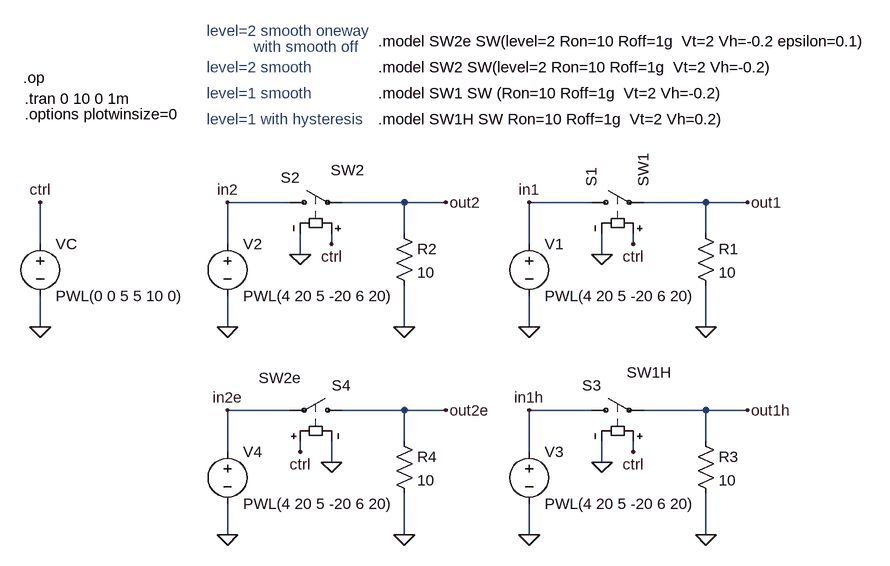
[diagram p0: schematic sw_level2_eps.asc]
sw_level2_eps.asc, the LTspice schematic file:
Version 4
SHEET 1 1444 680
WIRE 208 80 112 80
WIRE 384 80 288 80
WIRE 448 80 384 80
WIRE 672 80 576 80
WIRE 848 80 752 80
WIRE 912 80 848 80
WIRE 384 128 384 80
WIRE 848 128 848 80
WIRE -176 144 -176 80
WIRE 112 144 112 80
WIRE 272 144 272 128
WIRE 576 144 576 80
WIRE 736 144 736 128
WIRE 224 160 224 128
WIRE 688 160 688 128
WIRE -176 272 -176 224
WIRE 112 272 112 224
WIRE 384 272 384 208
WIRE 576 272 576 224
WIRE 848 272 848 208
WIRE 208 400 112 400
WIRE 384 400 288 400
WIRE 448 400 384 400
WIRE 672 400 576 400
WIRE 848 400 752 400
WIRE 912 400 848 400
WIRE 384 448 384 400
WIRE 848 448 848 400
WIRE 112 464 112 400
WIRE 224 464 224 448
WIRE 576 464 576 400
WIRE 736 464 736 448
WIRE 272 480 272 448
WIRE 688 480 688 448
WIRE 112 592 112 544
WIRE 384 592 384 528
WIRE 576 592 576 544
WIRE 848 592 848 528
FLAG 112 272 0
FLAG 384 272 0
FLAG 224 160 0
FLAG -176 272 0
FLAG 272 144 ctrl
FLAG -176 80 ctrl
FLAG 448 80 out2
FLAG 112 80 in2
FLAG 576 272 0
FLAG 848 272 0
FLAG 688 160 0
FLAG 736 144 ctrl
FLAG 912 80 out1
FLAG 576 80 in1
FLAG 576 592 0
FLAG 848 592 0
FLAG 688 480 0
FLAG 736 464 ctrl
FLAG 912 400 out1h
FLAG 576 400 in1h
FLAG 112 592 0
FLAG 384 592 0
FLAG 272 480 0
FLAG 224 464 ctrl
FLAG 448 400 out2e
FLAG 112 400 in2e
SYMBOL voltage 112 128 R0
SYMATTR InstName V2
SYMATTR Value PWL(4 20 5 -20 6 20)
SYMBOL sw 192 80 R270
WINDOW 0 38 2 VRight 0
WINDOW 3 50 79 VRight 0
SYMATTR InstName S2
SYMATTR Value SW2
SYMBOL voltage -176 128 R0
WINDOW 123 0 0 Left 0
WINDOW 39 0 0 Left 0
SYMATTR InstName VC
SYMATTR Value PWL(0 0 5 5 10 0)
SYMBOL res 368 112 R0
SYMATTR InstName R2
SYMATTR Value 10
SYMBOL voltage 576 128 R0
SYMATTR InstName V1
SYMATTR Value PWL(4 20 5 -20 6 20)
SYMBOL sw 656 80 R270
SYMATTR InstName S1
SYMATTR Value SW1
SYMBOL res 832 112 R0
SYMATTR InstName R1
SYMATTR Value 10
SYMBOL voltage 576 448 R0
SYMATTR InstName V3
SYMATTR Value PWL(4 20 5 -20 6 20)
SYMBOL sw 656 400 R270
WINDOW 0 38 2 VRight 0
WINDOW 3 58 70 VRight 0
SYMATTR InstName S3
SYMATTR Value SW1H
SYMBOL res 832 432 R0
SYMATTR InstName R3
SYMATTR Value 10
SYMBOL voltage 112 448 R0
WINDOW 123 0 0 Left 0
WINDOW 39 0 0 Left 0
SYMATTR InstName V4
SYMATTR Value PWL(4 20 5 -20 6 20)
SYMBOL sw 304 400 M270
WINDOW 0 38 2 VRight 0
WINDOW 3 50 79 VRight 0
SYMATTR InstName S4
SYMATTR Value SW2e
SYMBOL res 368 432 R0
SYMATTR InstName R4
SYMATTR Value 10
TEXT 344 -128 Left 0 !.model SW2 SW(level=2 Ron=10 Roff=1g  Vt=2 Vh=-0.2)
TEXT -202 -112 Left 0 !.op
TEXT 344 -88 Left 0 !.model SW1 SW (Ron=10 Roff=1g  Vt=2 Vh=-0.2)
TEXT 344 -48 Left 0 !.model SW1H SW Ron=10 Roff=1g  Vt=2 Vh=0.2)
TEXT -200 -80 Left 0 !.tran 0 10 0 1m
TEXT -200 -56 Left 0 !.options plotwinsize=0
TEXT 344 -168 Left 0 !.model SW2e SW(level=2 Ron=10 Roff=1g  Vt=2 Vh=-0.2 epsilon=0.1)
TEXT 80 -184 Left 0 ;level=2 smooth oneway
TEXT 80 -128 Left 0 ;level=2 smooth
TEXT 80 -88 Left 0 ;level=1 smooth
TEXT 80 -48 Left 0 ;level=1 with hysteresis
TEXT 152 -160 Left 0 ;with smooth off

The netlist it stands for:
* sw_level2_eps.asc
V2 in2 0 PWL(4 20 5 -20 6 20)
S2 in2 out2 ctrl 0 SW2
VC ctrl 0 PWL(0 0 5 5 10 0)
R2 out2 0 10
V1 in1 0 PWL(4 20 5 -20 6 20)
S1 in1 out1 ctrl 0 SW1
R1 out1 0 10
V3 in1h 0 PWL(4 20 5 -20 6 20)
S3 in1h out1h ctrl 0 SW1H
R3 out1h 0 10
V4 in2e 0 PWL(4 20 5 -20 6 20)
S4 out2e in2e ctrl 0 SW2e
R4 out2e 0 10
.model SW2 SW(level=2 Ron=10 Roff=1g  Vt=2 Vh=-0.2)
.op
.model SW1 SW (Ron=10 Roff=1g  Vt=2 Vh=-0.2)
.model SW1H SW Ron=10 Roff=1g  Vt=2 Vh=0.2)
.tran 0 10 0 1m
.options plotwinsize=0
.model SW2e SW(level=2 Ron=10 Roff=1g  Vt=2 Vh=-0.2 epsilon=0.1)
* level=2 smooth oneway
* level=2 smooth
* level=1 smooth
* level=1 with hysteresis
* with smooth off
.backanno
.end